# EAGLE design Current_Sense_Board (EAGLE 7.7.0)

## Sheet 1 of 2
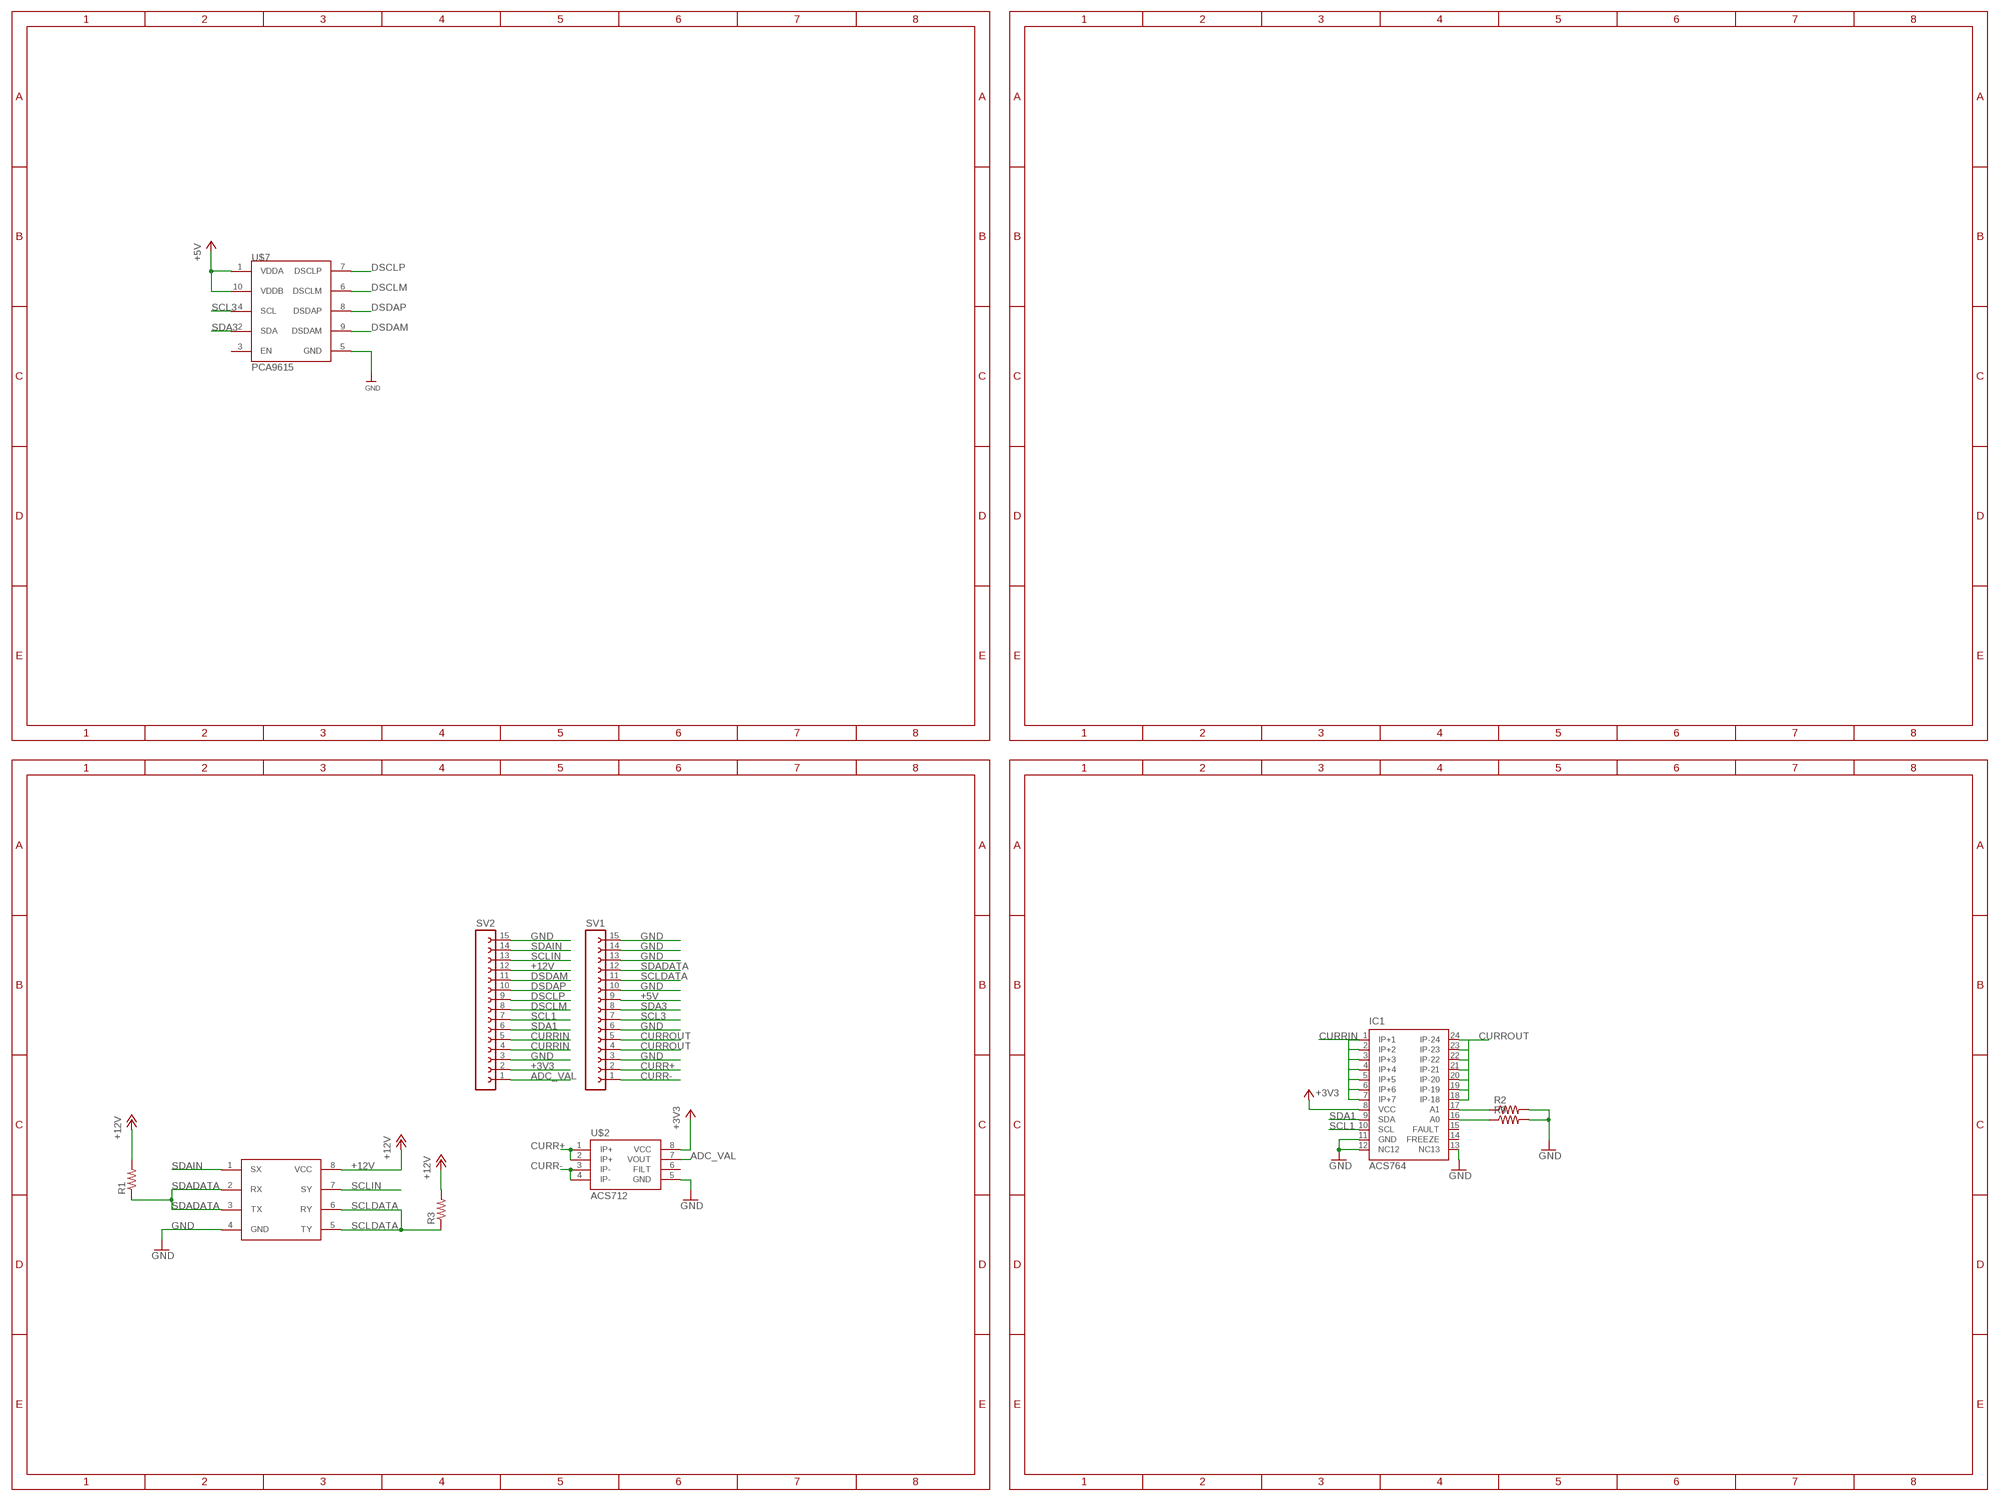
[diagram p0: schematic, sheet 1]

### Parts
IC1  ACS764  [SSOP24]
R1  RESISTOR0603  [0603-RES]
R2  RESISTOR0603  [0603-RES]
R3  RESISTOR0603  [0603-RES]
R9  RESISTOR0603  [0603-RES]
SV1  FE15-1  [FE15]
SV2  FE15-1  [FE15]
U$1  PCA9000  [TSSOP8]
U$2  ACS712  [SO08]
U$7  PCA9615  [MSOP_10]

### Nets
+3V3: IC1.8(VCC) SV2.2 U$2.8(VCC)
+5V: SV1.9 U$7.1(VDDA) U$7.10(VDDB)
+12V: R1.2 R3.2 SV2.12 U$1.8(VCC)
ADC_VAL: SV2.1 U$2.7(VOUT)
CURR+: SV1.2 U$2.1(IP+) U$2.2(IP+)
CURR-: SV1.1 U$2.3(IP-) U$2.4(IP-)
CURRIN: IC1.1(IP+1) IC1.2(IP+2) IC1.3(IP+3) IC1.4(IP+4) IC1.5(IP+5) IC1.6(IP+6) IC1.7(IP+7) SV2.4 SV2.5
CURROUT: IC1.18(IP-18) IC1.19(IP-19) IC1.20(IP-20) IC1.21(IP-21) IC1.22(IP-22) IC1.23(IP-23) IC1.24(IP-24) SV1.4 SV1.5
DSCLM: SV2.8 U$7.6(DSCLM)
DSCLP: SV2.9 U$7.7(DSCLP)
DSDAM: SV2.11 U$7.9(DSDAM)
DSDAP: SV2.10 U$7.8(DSDAP)
GND: IC1.11(GND) IC1.12(NC12) IC1.13(NC13) R2.2 R9.2 SV1.3 SV1.6 SV1.10 SV1.13 SV1.14 SV1.15 SV2.3 SV2.15 U$1.4(GND) U$2.5(GND) U$7.5(GND)
N$1: IC1.17(A1) R2.1
N$2: IC1.16(A0) R9.1
SCL1: IC1.10(SCL) SV2.7
SCL3: SV1.7 U$7.4(SCL)
SCLDATA: R3.1 SV1.11 U$1.5(TY) U$1.6(RY)
SCLIN: SV2.13 U$1.7(SY)
SDA1: IC1.9(SDA) SV2.6
SDA3: SV1.8 U$7.2(SDA)
SDADATA: R1.1 SV1.12 U$1.2(RX) U$1.3(TX)
SDAIN: SV2.14 U$1.1(SX)
Unconnected: IC1.14(FREEZE) IC1.15(FAULT) U$2.6(FILT) U$7.3(EN)

## Sheet 2 of 2

## Library data of the parts
IC1 = ACS764:ACS764: 8-bit Microcontroller with Multiprotocol Smart Card Interface Source: Uploaded by Heiko Künzel <heiko.kuenzel@atg-gera.de> from ATG Automatisierungstechnik Gera Mon Mar 10 13:32:48 2003 Atmel-Library mit zusätzlich T83C5121-Prozessor im SSOP24-Package.; OC_FARNELL: unknown; OC_NEWARK: unknown
R1-R3 R9 = SparkFun-Resistors:RESISTOR: Resistor Basic schematic elements and footprints for 0603, 1206, and PTH resistors.
SV1 SV2 = con-lsta:FE15-1: FEMALE HEADER; OC_FARNELL: unknown; OC_NEWARK: unknown
U$1 = test_lib:PCA9000
U$2 = SparkFun-AnalogIC:ACS712: Hall-effect-based isolated linear current sensor; PROD_ID: IC-08964
U$7 = test_lib:PCA9615

## Board
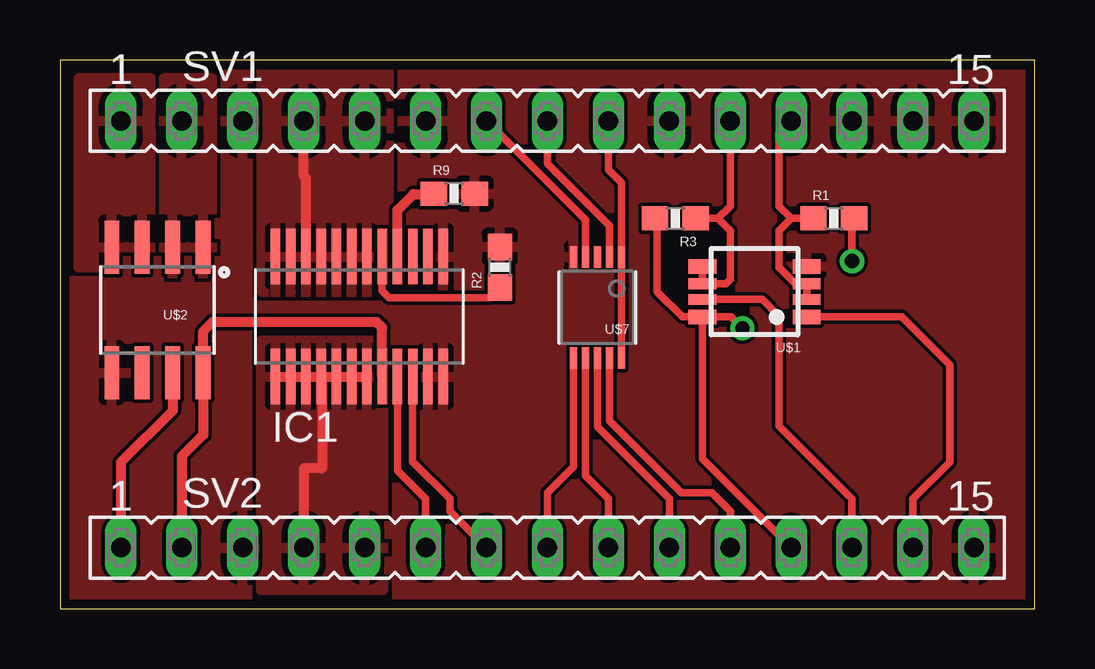
[diagram p1: board, top side]
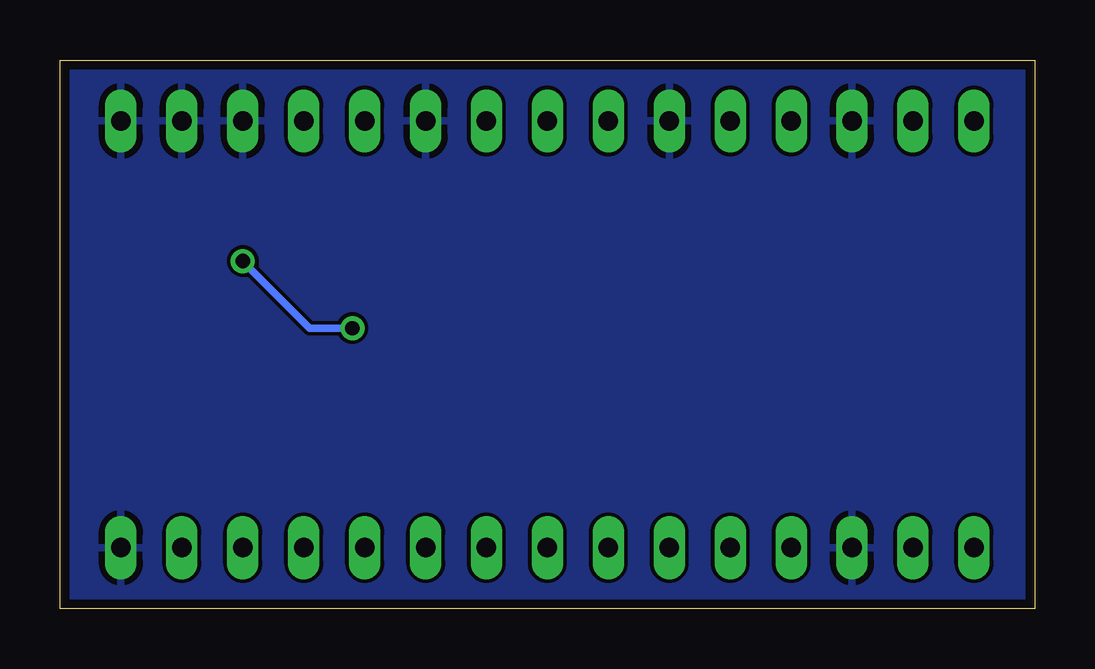
[diagram p2: board, bottom side, seen from below]

Size 40.64 x 22.86 mm. Coordinates in mm from the lower left corner, seen from the top.
Outline: 0,0 40.64,0 40.64,22.86 0,22.86 0,0
Copper layers (1*16): Top 0.035559375mm / dielectric 1.501140625mm / Bottom 0.035559375mm
Design rules "typical_4pcb": minimum track width 10mil, minimum drill 15mil, track to track 6mil, track to pad 6mil, pad to pad 6mil, via to via 6mil, smd to smd 6mil, copper to edge 15mil, drill to drill 8mil, minimum pad ring 10mil, minimum via ring 8mil, stop-mask expansion 4mil, vias tented up to drill 0mil, thermal gap 10mil

### Footprints (pad centres in the part's own frame; a part is rotated, then mirrored left to right if it is on the bottom)
SSOP24 = smd 0.4 x 2.3: 1 -3.51,-2.47; 2 -2.875,-2.47; 3 -2.24,-2.47; 4 -1.605,-2.47; 5 -0.97,-2.47; 6 -0.335,-2.47; 7 0.3,-2.47; 8 0.935,-2.47; 9 1.57,-2.47; 10 2.205,-2.47; 11 2.84,-2.47; 12 3.475,-2.47; 13 3.475,2.53; 14 2.84,2.53; 15 2.205,2.53; 16 1.57,2.53; 17 0.935,2.53; 18 0.3,2.53; 19 -0.335,2.53; 20 -0.97,2.53; 21 -1.605,2.53; 22 -2.24,2.53; 23 -2.875,2.53; 24 -3.51,2.53
0603-RES = smd 1.1 x 1: 1 -0.85,0; 2 0.85,0
FE15 = drill 0.813 long: 1 -17.78,0; 2 -15.24,0; 3 -12.7,0; 4 -10.16,0; 5 -7.62,0; 6 -5.08,0; 7 -2.54,0; 8 0,0; 9 2.54,0; 10 5.08,0; 11 7.62,0; 12 10.16,0; 13 12.7,0; 14 15.24,0; 15 17.78,0
TSSOP8 = smd 0.6 x 1.15: 1 -1.05,-2.175; 4 1.05,-2.175; 5 1.05,2.175; 8 -1.05,2.175 | smd 0.45 x 1.15: 2 -0.325,-2.175; 3 0.325,-2.175; 6 0.325,2.175; 7 -0.325,2.175
SO08 = smd 0.61 x 2.21: 1 -1.905,-2.616; 2 -0.635,-2.616; 3 0.635,-2.616; 4 1.905,-2.616; 5 1.905,2.616; 6 0.635,2.616; 7 -0.635,2.616; 8 -1.905,2.616
MSOP_10 = smd 0.305 x 0.889: 1 -1,-2.11; 2 -0.5,-2.11; 3 0,-2.11; 4 0.5,-2.11; 5 1,-2.11; 6 1,2.11; 7 0.5,2.11; 8 0,2.11; 9 -0.5,2.11; 10 -1,2.11

### Placement (x,y rotation side)
IC1  12.5,12.14 0 top
R1  32.26,16.26 0 top
R2  18.34,14.22 90 top
R3  25.65,16.26 180 top
R9  16.43,17.3 0 top
SV1  20.32,20.32 0 top
SV2  20.32,2.54 0 top
U$1  28.96,13.21 90 top
U$2  4.06,12.45 180 top
U$7  22.4,12.55 180 top

### Tracks (layer width: path | path; a pad name or v marks a point on that pad's centre or on a via)
+3V3
  Top 0.406: SV2.2 5.08,6.35 5.97,7.24 U$2.8 5.97,11.56 6.35,11.94 13.21,11.94 13.43,11.71 IC1.8
+5V
  Top 0.305: SV1.9 22.86,18.29 23.4,17.75 U$7.1 U$7.10
+12V  (via drill 0.6)
  Top 0.305: U$1.8 26.78,6.24 SV2.12 | U$1.8 25.94,12.16 24.89,13.21 24.89,16.17 R3.2 | U$1.8 27.97,12.16 v28.45,11.68 | v33.02,14.48 33.02,16.17 R1.2
  Bottom 0.305: v28.45,11.68 30.23,11.68 v33.02,14.48
ADC_VAL
  Top 0.406: U$2.7 4.7,8.26 2.54,6.1 SV2.1
CURR+
  pour Top: 4.32,13.97 6.35,13.97 6.35,22.1 4.32,22.1
CURR-
  pour Top (rank 2): 0.76,14.22 3.81,14.22 3.81,22.1 0.76,22.1
CURRIN
  Top 0.406: IC1.1 IC1.2 | IC1.2 9.63,9.67 9.65,9.65 | IC1.2 IC1.3 | IC1.3 10.39,9.67 10.41,9.65 10.92,9.65 | IC1.3 IC1.4 | IC1.4 10.9,9.67 10.92,9.65 | IC1.4 11.41,9.67 11.43,9.65 | IC1.5 IC1.6 | IC1.6 12.17,9.67 12.19,9.65 | IC1.6 12.68,9.67 12.7,9.65 | 10.92,9.65 10.92,5.84 10.16,5.84 SV2.4
  pour Top: 8.38,11.18 13.46,11.18 13.46,0.76 8.38,0.76
CURROUT
  Top 0.406: IC1.22 10.26,17.94 10.16,18.03 SV1.4
  pour Top: 8.38,13.21 13.72,13.21 13.72,22.35 8.38,22.35
DSCLM
  Top 0.305: U$7.6 21.4,5.91 20.32,4.83 SV2.8
DSCLP
  Top 0.305: U$7.7 21.9,5.53 22.86,4.57 SV2.9
DSDAM
  Top 0.305: U$7.9 22.9,7.83 25.91,4.83 27.18,4.83 27.94,4.06 SV2.11
DSDAP
  Top 0.305: U$7.8 22.4,7.57 25.4,4.57 SV2.10
GND
  pour Top (rank 6): 0,0 65.53,0 65.53,22.86 0,22.86
  pour Bottom (rank 6): 0.25,0.25 0.25,22.61 65.79,22.61 65.79,0.25
N$1
  Top 0.305: IC1.17 13.43,13.24 13.72,12.95 17.92,12.95 R2.1
N$2
  Top 0.406: IC1.16 14.07,16.61 14.73,17.27 15.56,17.27 R9.1
SCL1
  Top 0.305: IC1.10 14.7,6.13 16.26,4.57 16.26,4.06 SV2.7
SCL3
  Top 0.305: U$7.4 21.9,16.2 SV1.7
SCLDATA
  Top 0.305: R3.1 27.43,16.26 | 27.43,16.26 27.94,16.76 SV1.11 | 27.43,16.26 27.94,15.75 27.94,13.72 27.76,13.53 U$1.6 U$1.5
SCLIN
  Top 0.305: U$1.7 29.28,12.88 29.97,12.19 29.97,7.62 33.02,4.57 SV2.13
SDA1
  Top 0.305: IC1.9 14.07,5.75 15.24,4.57 SV2.6
SDA3
  Top 0.305: U$7.2 22.9,15.96 20.32,18.54 SV1.8
SDADATA
  Top 0.305: U$1.2 U$1.3 30.66,13.53 29.97,14.22 29.97,15.75 30.48,16.26 | SV1.12 29.97,19.81 29.97,16.76 30.48,16.26 | R1.1 30.48,16.26
SDAIN
  Top 0.305: U$1.1 35.09,12.16 37.08,10.16 37.08,6.1 35.56,4.57 SV2.14